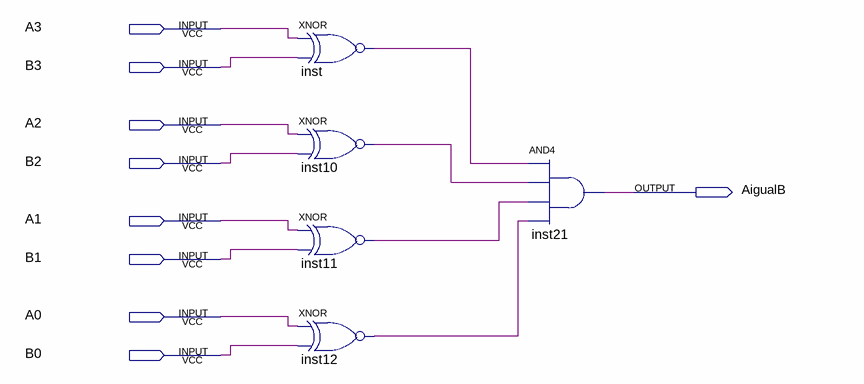
[diagram p0: schematic sheet]
// Quartus schematic Comparator_AigualB.bdf as structural Verilog: 5 symbols, 9 pins
module Comparator_AigualB (
  input  A3,
  input  B3,
  input  A2,
  input  B2,
  input  A1,
  input  B1,
  input  A0,
  input  B0,
  output AigualB
);

  wire inst10_out, inst11_out, inst12_out, inst_out;

  xnor inst (inst_out, A3, B3);
  xnor inst10 (inst10_out, A2, B2);
  xnor inst11 (inst11_out, A1, B1);
  xnor inst12 (inst12_out, A0, B0);
  and inst21 (AigualB, inst_out, inst10_out, inst11_out, inst12_out);
endmodule
